# Altium schematic sheet NB992F_POWER_V17.SchDoc
size A4
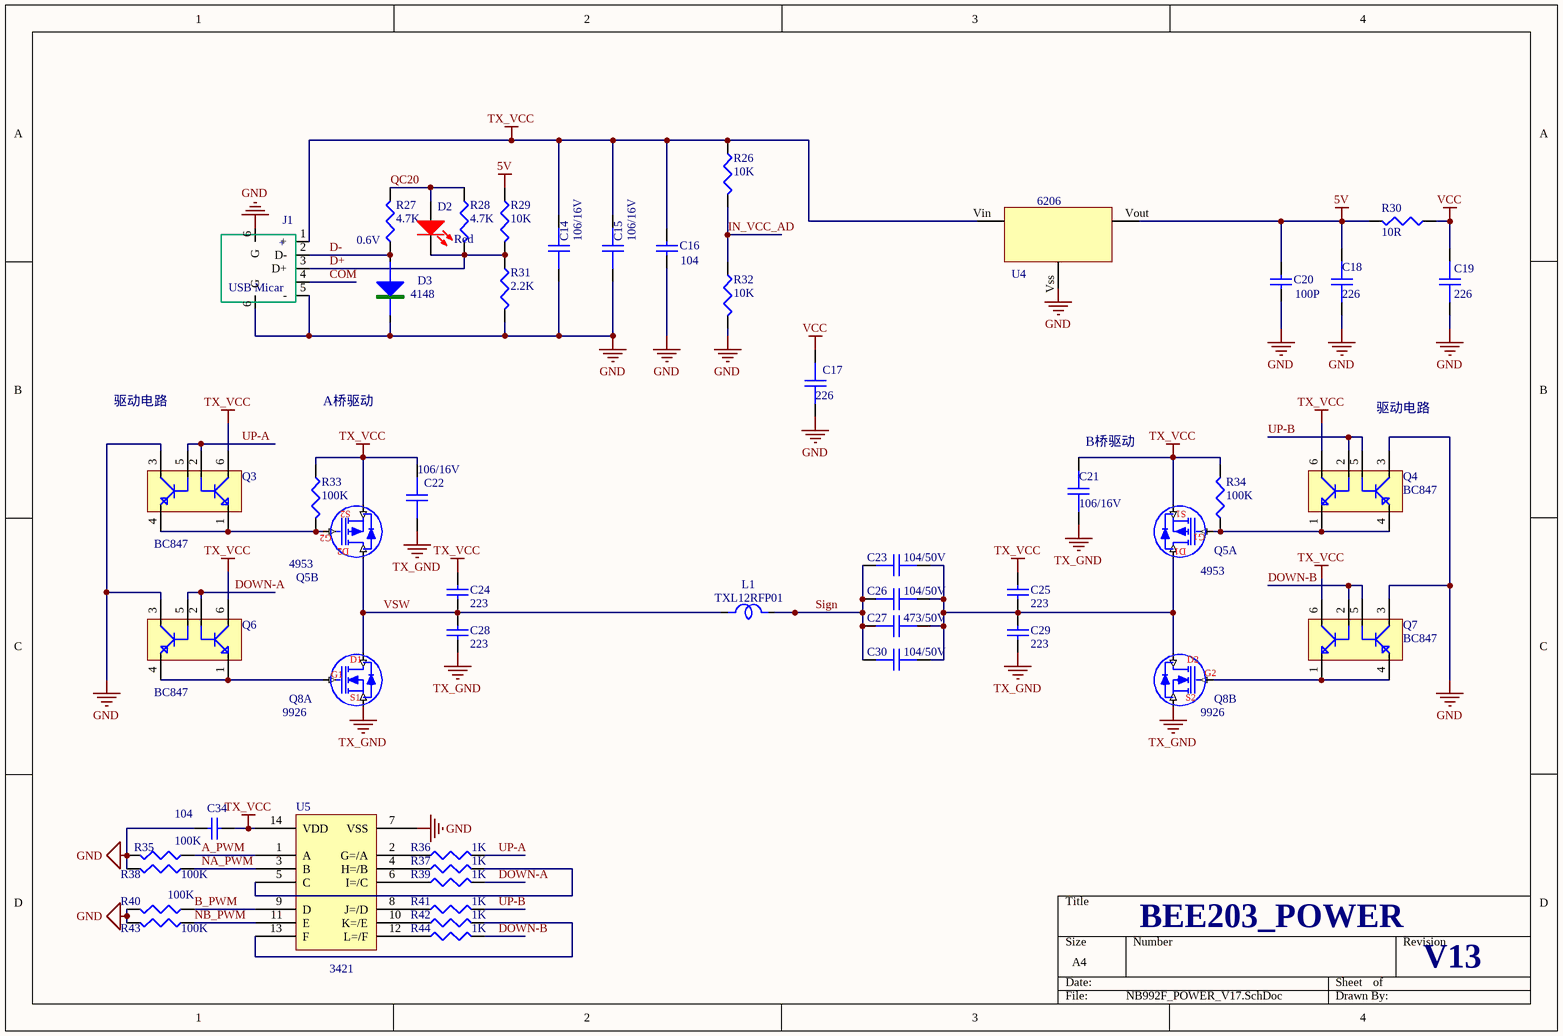
[diagram p0: NB992F_POWER_V17.SchDoc]

## Parts
C14  106/16V  [C0805]
C15  106/16V  [C0805]
C16  104  [C0402]
C17  226  [C0603]
C18  226  [C0805]
C19  226  [C0805]
C20  100P  [C0402]
C21  106/16V  [C0805]
C22  106/16V  [C0805]
C23  104/50V  [C1206]
C24  223  [C0603]
C25  223  [C0603]
C26  104/50V  [C1206]
C27  473/50V  [C1206]
C28  223  [C0603]
C29  223  [C0603]
C30  104/50V  [C1206]
C34  104  [C0402]
D2  Red  [LED0603]
D3  4148  [SOD323]
J1  USB Micar  [USB MRO]
L1  TXL12RFP01  [SPIN2_5mm]
Q3  BC847  [SOT-363]
Q4  BC847  [SOT-363]
Q5  4953  [SOP8D]  (parts A,B of 2)
Q6  BC847  [SOT-363]
Q7  BC847  [SOT-363]
Q8  9926  [SOP8D]  (parts A,B of 2)
R26  10K  [R0402]
R27  4.7K  [R0402]
R28  4.7K  [R0402]
R29  10K  [R0402]
R30  10R  [R0402]
R31  2.2K  [R0402]
R32  10K  [R0402]
R33  100K  [R0402]
R34  100K  [R0402]
R35  100K  [R0402]
R36  1K  [R0402]
R37  1K  [R0402]
R38  100K  [R0402]
R39  1K  [R0402]
R40  100K  [R0402]
R41  1K  [R0402]
R42  1K  [R0402]
R43  100K  [R0402]
R44  1K  [R0402]
U4  6206  [SOT-89-5V]
U5  3421  [SOP14]

## Nets
5V: C18.1 C20.1 R29.2 R30.2 U4.Vout
GND: C14.2 C15.2 C16.2 C17.1 C18.2 C19.1 C20.2 C34.1 D3.2 J1.5(-) J1.6(G) Q3.3 Q4.3 Q6.3 Q7.3 R31.1 R32.1 R35.2 R38.2 R40.2 R43.2 U4.Vss U5.7(VSS)
TX_GND: C21.2 C22.2 C28.1 C29.1 Q8.E1(S1) Q8.E2(S2)
TX_VCC: C14.1 C15.1 C16.1 C21.1 C22.1 C24.2 C25.2 C34.2 J1.1(+) Q3.6 Q4.6 Q5.E1(S1) Q5.E2(S2) Q6.6 Q7.6 R26.2 R33.1 R34.2 U4.Vin U5.14(VDD)
VCC: C17.2 C19.2 R30.1
A_PWM: R35.1 U5.1(A)
B_PWM: R40.1 U5.9(D)
COM: J1.4
D+: D2.2(K) J1.3(D+) R28.1 R29.1 R31.2
D-: D3.1 J1.2(D-) R27.2
DOWN-A: Q6.2 Q6.5 R39.2
DOWN-B: Q7.2 Q7.5 R44.2
IN_VCC_AD: R26.1 R32.2
NA_PWM: R38.1 U5.3(B)
NB_PWM: R43.1 U5.11(E)
QC20: D2.1(A) R27.1 R28.2
Sign: C23.1 C26.1 C27.1 C30.1 L1.2
UP-A: Q3.2 Q3.5 R36.2
UP-B: Q4.2 Q4.5 R41.2
VSW: C24.1 C28.2 L1.1 Q5.C2(D2) Q8.C1(D1)
NetC23_2: C23.2 C25.1 C26.2 C27.2 C29.2 C30.2 Q5.C1(D1) Q8.C2(D2)
NetQ3_1: Q3.1 Q3.4 Q5.B2(G2) R33.2
NetQ4_1: Q4.1 Q4.4 Q5.B1(G1) R34.1
NetQ6_1: Q6.1 Q6.4 Q8.B1(G1)
NetQ7_1: Q7.1 Q7.4 Q8.B2(G2)
NetR36_1: R36.1 U5.2(G=/A)
NetR37_1: R37.1 U5.4(H=/B)
NetR37_2: R37.2 U5.5(C)
NetR39_1: R39.1 U5.6(I=/C)
NetR41_1: R41.1 U5.8(J=/D)
NetR42_1: R42.1 U5.10(K=/E)
NetR42_2: R42.2 U5.13(F)
NetR44_1: R44.1 U5.12(L=/F)

## Notes on the sheet
- 0.6V
- 혜땡든쨌
- A픕혜땡
- (near C21) B픕혜땡
- BEE203_POWER
- V13

## Library data of the parts
C14 C15 C17-C19 C21-C23 C26 C27 C30 = CH
C16 C34 = Cap: Capacitor; Published: 8-Jun-2000; LatestRevisionDate: 17-Jul-2002; LatestRevisionNote: Re-released for DXP Platform.; Publisher: Altium Limited; Value: 104
C20 C24 C25 C28 C29 = Cap: Capacitor; Value: 104; Published: 8-Jun-2000; LatestRevisionDate: 17-Jul-2002; LatestRevisionNote: Re-released for DXP Platform.; Publisher: Altium Limited
D2 = LED02
D3 = D0: 1N4001
J1 = USB
L1 = L: 1uH
Q3 Q4 Q6 Q7 = D_PNP
Q5 = MOSFETP2
Q8 = MOSFETN2
R26-R35 R38 R40 R43 = R: 1K
R36 R37 R39 R41 R42 R44 = R
U4 = VOLTREG
U5 = CD4069